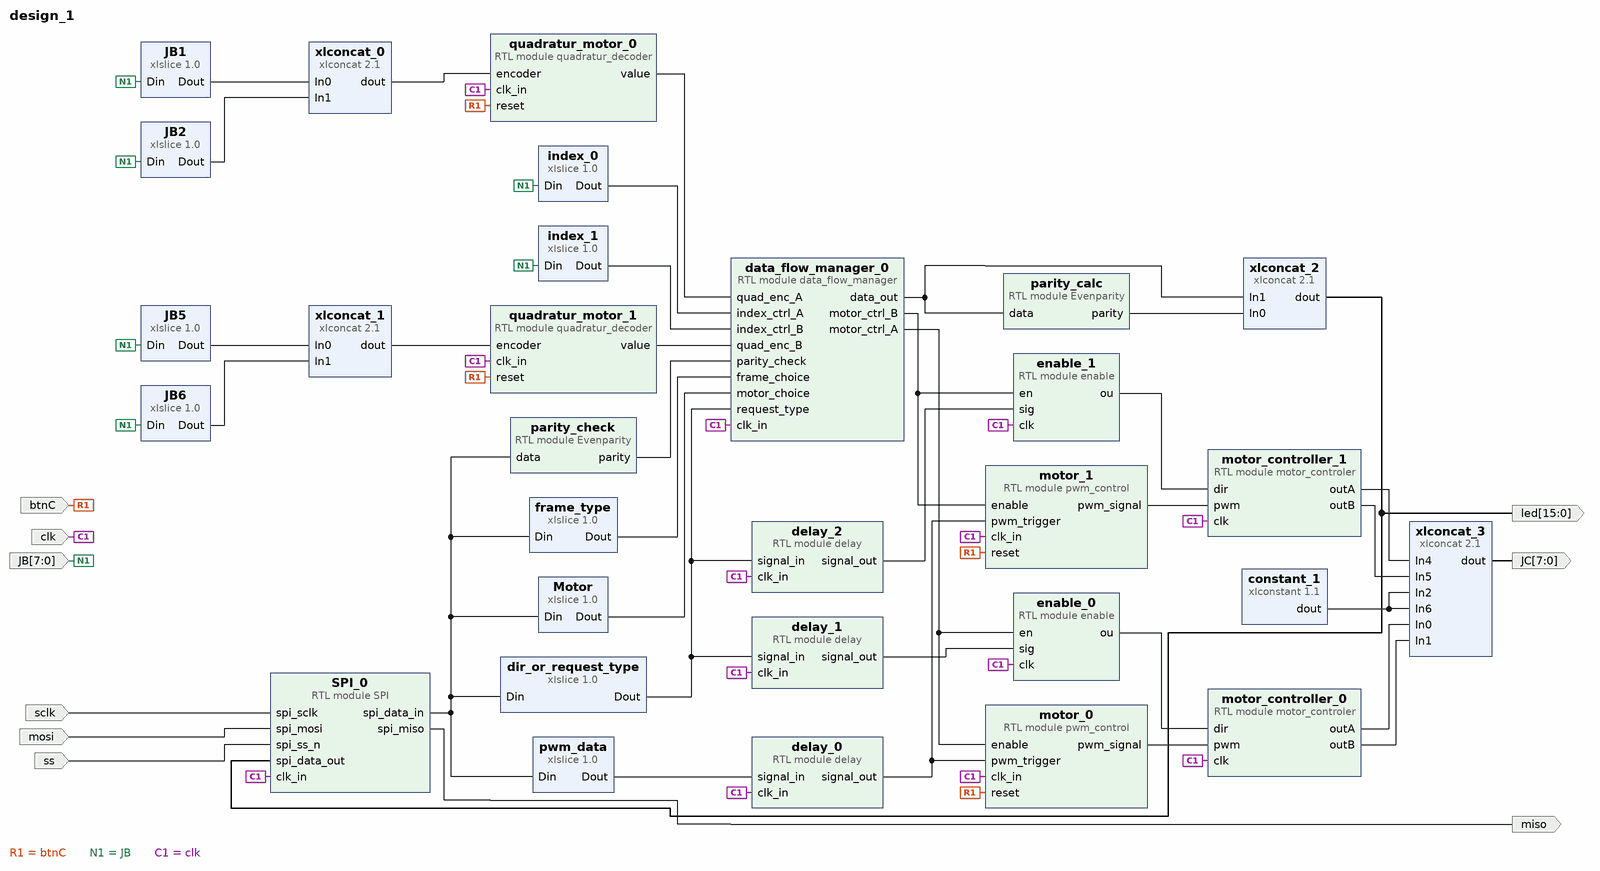
[diagram p0: block diagram of the top level]
# Vivado block design design_1, xc7a35tcpg236-1, Vivado 2019.2
create_bd_design design_1

create_bd_port -dir I clk
create_bd_port -dir I sclk
create_bd_port -dir I mosi
create_bd_port -dir I ss
create_bd_port -dir O -from 15 -to 0 led
create_bd_port -dir O miso
create_bd_port -dir I -type rst btnC
create_bd_port -dir I -from 7 -to 0 JB
create_bd_port -dir O -from 7 -to 0 JC

create_bd_cell -type ip -vlnv xilinx.com:ip:xlslice:1.0 frame_type
set_property -dict {CONFIG.DIN_FROM 15 CONFIG.DIN_TO 15 CONFIG.DIN_WIDTH 16 CONFIG.DOUT_WIDTH 1} [get_bd_cells frame_type]
create_bd_cell -type ip -vlnv xilinx.com:ip:xlslice:1.0 Motor
set_property -dict {CONFIG.DIN_FROM 14 CONFIG.DIN_TO 14 CONFIG.DIN_WIDTH 16} [get_bd_cells Motor]
create_bd_cell -type ip -vlnv xilinx.com:ip:xlslice:1.0 dir_or_request_type
set_property -dict {CONFIG.DIN_FROM 13 CONFIG.DIN_TO 13 CONFIG.DIN_WIDTH 16} [get_bd_cells dir_or_request_type]
create_bd_cell -type ip -vlnv xilinx.com:ip:xlslice:1.0 pwm_data
set_property -dict {CONFIG.DIN_FROM 12 CONFIG.DIN_TO 4 CONFIG.DIN_WIDTH 16 CONFIG.DOUT_WIDTH 9} [get_bd_cells pwm_data]
create_bd_cell -type ip -vlnv xilinx.com:ip:xlconcat:2.1 xlconcat_0
create_bd_cell -type ip -vlnv xilinx.com:ip:xlconcat:2.1 xlconcat_1
create_bd_cell -type ip -vlnv xilinx.com:ip:xlslice:1.0 JB1
set_property -dict {CONFIG.DIN_FROM 1 CONFIG.DIN_TO 1 CONFIG.DIN_WIDTH 8} [get_bd_cells JB1]
create_bd_cell -type ip -vlnv xilinx.com:ip:xlslice:1.0 JB2
set_property -dict {CONFIG.DIN_FROM 2 CONFIG.DIN_TO 2 CONFIG.DIN_WIDTH 8 CONFIG.DOUT_WIDTH 1} [get_bd_cells JB2]
create_bd_cell -type ip -vlnv xilinx.com:ip:xlslice:1.0 JB5
set_property -dict {CONFIG.DIN_FROM 5 CONFIG.DIN_TO 5 CONFIG.DIN_WIDTH 8} [get_bd_cells JB5]
create_bd_cell -type ip -vlnv xilinx.com:ip:xlslice:1.0 JB6
set_property -dict {CONFIG.DIN_FROM 6 CONFIG.DIN_TO 6 CONFIG.DIN_WIDTH 8 CONFIG.DOUT_WIDTH 1} [get_bd_cells JB6]
create_bd_cell -type ip -vlnv xilinx.com:ip:xlconcat:2.1 xlconcat_2
set_property -dict {CONFIG.IN0_WIDTH 1 CONFIG.IN1_WIDTH 15 CONFIG.NUM_PORTS 2} [get_bd_cells xlconcat_2]
create_bd_cell -type module -reference delay delay_0
set_property -dict {CONFIG.clock 1 CONFIG.ports 9} [get_bd_cells delay_0]
create_bd_cell -type ip -vlnv xilinx.com:ip:xlslice:1.0 index_1
set_property -dict {CONFIG.DIN_FROM 4 CONFIG.DIN_TO 4 CONFIG.DIN_WIDTH 8 CONFIG.DOUT_WIDTH 1} [get_bd_cells index_1]
create_bd_cell -type ip -vlnv xilinx.com:ip:xlslice:1.0 index_0
set_property -dict {CONFIG.DIN_FROM 0 CONFIG.DIN_TO 0 CONFIG.DIN_WIDTH 8 CONFIG.DOUT_WIDTH 1} [get_bd_cells index_0]
create_bd_cell -type ip -vlnv xilinx.com:ip:xlconcat:2.1 xlconcat_3
set_property -dict {CONFIG.NUM_PORTS 8} [get_bd_cells xlconcat_3]
create_bd_cell -type ip -vlnv xilinx.com:ip:xlconstant:1.1 constant_1
create_bd_cell -type module -reference delay delay_1
set_property -dict {CONFIG.clock 1 CONFIG.ports 1} [get_bd_cells delay_1]
create_bd_cell -type module -reference delay delay_2
set_property -dict {CONFIG.clock 1 CONFIG.ports 1} [get_bd_cells delay_2]
create_bd_cell -type module -reference enable enable_0
create_bd_cell -type module -reference enable enable_1
create_bd_cell -type module -reference motor_controler motor_controller_0
create_bd_cell -type module -reference motor_controler motor_controller_1
create_bd_cell -type module -reference pwm_control motor_0
create_bd_cell -type module -reference pwm_control motor_1
create_bd_cell -type module -reference SPI SPI_0
create_bd_cell -type module -reference quadratur_decoder quadratur_motor_0
create_bd_cell -type module -reference quadratur_decoder quadratur_motor_1
create_bd_cell -type module -reference Evenparity parity_check
create_bd_cell -type module -reference Evenparity parity_calc
create_bd_cell -type module -reference data_flow_manager data_flow_manager_0

# ---- connections ----

connect_bd_net -net state_machine_0_motor_ctrl_A [get_bd_pins data_flow_manager_0/motor_ctrl_A] [get_bd_pins enable_0/en] [get_bd_pins motor_0/enable]
connect_bd_net -net state_machine_0_motor_ctrl_B [get_bd_pins data_flow_manager_0/motor_ctrl_B] [get_bd_pins enable_1/en] [get_bd_pins motor_1/enable]
connect_bd_net -net delay_0_output [get_bd_pins delay_0/signal_out] [get_bd_pins motor_0/pwm_trigger] [get_bd_pins motor_1/pwm_trigger]
connect_bd_net -net reset_0_1 [get_bd_ports btnC] \
  [get_bd_pins motor_0/reset] [get_bd_pins motor_1/reset] [get_bd_pins quadratur_motor_0/reset] \
  [get_bd_pins quadratur_motor_1/reset]
connect_bd_net -net xlslice_2_Dout [get_bd_pins dir_or_request_type/Dout] \
  [get_bd_pins delay_2/signal_in] [get_bd_pins delay_1/signal_in] [get_bd_pins data_flow_manager_0/request_type]
connect_bd_net -net JB0_Dout [get_bd_pins JB1/Dout] [get_bd_pins xlconcat_0/In0]
connect_bd_net -net JB1_Dout [get_bd_pins JB2/Dout] [get_bd_pins xlconcat_0/In1]
connect_bd_net -net JC0_Dout [get_bd_pins JB5/Dout] [get_bd_pins xlconcat_1/In0]
connect_bd_net -net JC1_Dout [get_bd_pins JB6/Dout] [get_bd_pins xlconcat_1/In1]
connect_bd_net -net state_machine_0_data_out [get_bd_pins data_flow_manager_0/data_out] [get_bd_pins xlconcat_2/In1] [get_bd_pins parity_calc/data]
connect_bd_net [get_bd_pins parity_calc/parity] [get_bd_pins xlconcat_2/In0]
connect_bd_net [get_bd_pins pwm_data/Dout] [get_bd_pins delay_0/signal_in]
connect_bd_net [get_bd_ports JB] \
  [get_bd_pins JB1/Din] [get_bd_pins JB2/Din] [get_bd_pins JB5/Din] [get_bd_pins JB6/Din] [get_bd_pins index_0/Din] \
  [get_bd_pins index_1/Din]
connect_bd_net [get_bd_pins xlconcat_3/dout] [get_bd_ports JC]
connect_bd_net [get_bd_pins constant_1/dout] [get_bd_pins xlconcat_3/In2] [get_bd_pins xlconcat_3/In6]
connect_bd_net [get_bd_pins motor_0/pwm_signal] [get_bd_pins motor_controller_0/pwm]
connect_bd_net [get_bd_pins motor_1/pwm_signal] [get_bd_pins motor_controller_1/pwm]
connect_bd_net [get_bd_pins delay_1/signal_out] [get_bd_pins enable_0/sig]
connect_bd_net [get_bd_pins enable_0/ou] [get_bd_pins motor_controller_0/dir]
connect_bd_net [get_bd_pins delay_2/signal_out] [get_bd_pins enable_1/sig]
connect_bd_net [get_bd_pins enable_1/ou] [get_bd_pins motor_controller_1/dir]
connect_bd_net -net motor_controler_0_outA [get_bd_pins motor_controller_0/outA] [get_bd_pins xlconcat_3/In0]
connect_bd_net -net motor_controler_0_outB [get_bd_pins motor_controller_0/outB] [get_bd_pins xlconcat_3/In1]
connect_bd_net -net motor_controler_1_outA [get_bd_pins motor_controller_1/outA] [get_bd_pins xlconcat_3/In4]
connect_bd_net -net motor_controler_1_outB [get_bd_pins motor_controller_1/outB] [get_bd_pins xlconcat_3/In5]
connect_bd_net [get_bd_pins xlconcat_0/dout] [get_bd_pins quadratur_motor_0/encoder]
connect_bd_net [get_bd_pins xlconcat_1/dout] [get_bd_pins quadratur_motor_1/encoder]
connect_bd_net [get_bd_pins xlconcat_2/dout] [get_bd_pins SPI_0/spi_data_out] [get_bd_ports led]
connect_bd_net [get_bd_ports clk] \
  [get_bd_pins SPI_0/clk_in] [get_bd_pins enable_0/clk] [get_bd_pins delay_1/clk_in] [get_bd_pins motor_0/clk_in] \
  [get_bd_pins motor_1/clk_in] [get_bd_pins delay_0/clk_in] [get_bd_pins enable_1/clk] [get_bd_pins delay_2/clk_in] \
  [get_bd_pins quadratur_motor_1/clk_in] [get_bd_pins quadratur_motor_0/clk_in] [get_bd_pins data_flow_manager_0/clk_in] \
  [get_bd_pins motor_controller_1/clk] [get_bd_pins motor_controller_0/clk]
connect_bd_net [get_bd_pins quadratur_motor_0/value] [get_bd_pins data_flow_manager_0/quad_enc_A]
connect_bd_net [get_bd_pins quadratur_motor_1/value] [get_bd_pins data_flow_manager_0/quad_enc_B]
connect_bd_net [get_bd_pins Motor/Dout] [get_bd_pins data_flow_manager_0/motor_choice]
connect_bd_net [get_bd_pins parity_check/parity] [get_bd_pins data_flow_manager_0/parity_check]
connect_bd_net [get_bd_pins index_0/Dout] [get_bd_pins data_flow_manager_0/index_ctrl_A]
connect_bd_net [get_bd_pins index_1/Dout] [get_bd_pins data_flow_manager_0/index_ctrl_B]
connect_bd_net [get_bd_pins frame_type/Dout] [get_bd_pins data_flow_manager_0/frame_choice]
connect_bd_net [get_bd_ports sclk] [get_bd_pins SPI_0/spi_sclk]
connect_bd_net [get_bd_pins SPI_0/spi_miso] [get_bd_ports miso]
connect_bd_net [get_bd_pins SPI_0/spi_data_in] \
  [get_bd_pins pwm_data/Din] [get_bd_pins dir_or_request_type/Din] [get_bd_pins frame_type/Din] \
  [get_bd_pins parity_check/data] [get_bd_pins Motor/Din]
connect_bd_net [get_bd_ports mosi] [get_bd_pins SPI_0/spi_mosi]
connect_bd_net [get_bd_ports ss] [get_bd_pins SPI_0/spi_ss_n]

validate_bd_design
save_bd_design
